# Altium schematic sheet nRF24L01-Module.SchDoc
size A4
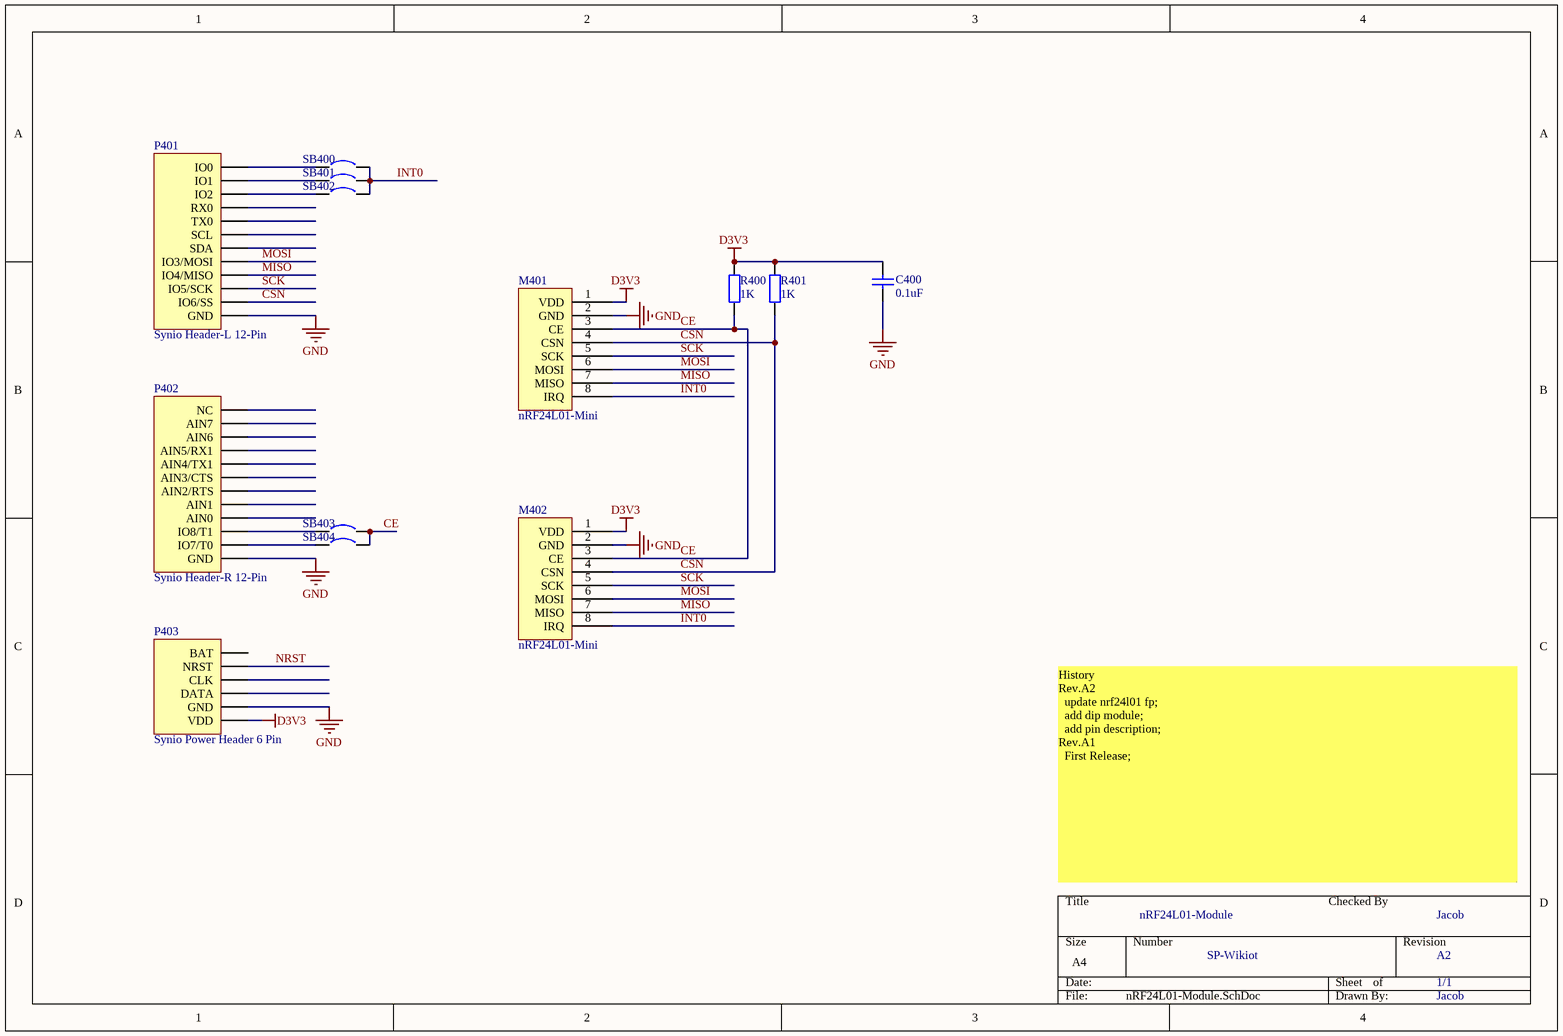
[diagram p0: nRF24L01-Module.SchDoc]

## Parts
C400  0.1uF  [C0603L]
M401  nRF24L01-Mini  [nRF24L01-Mini-All]
M402  nRF24L01-Mini  [nRF24L01-DIP]
P401  Synio Header-L 12-Pin  [HDR1X12]
P402  Synio Header-R 12-Pin  [HDR1X12]
P403  Synio Power Header 6 Pin  [HDR1X6/2.54MM]
R400  1K  [R0603]
R401  1K  [R0603]
SB400  Circuit Breaker  [JP2_SMD]  (value not drawn)
SB401  Circuit Breaker  [JP2_SMD]  (value not drawn)
SB402  Circuit Breaker  [JP2_SMD]  (value not drawn)
SB403  Circuit Breaker  [JP2_SMD]  (value not drawn)
SB404  Circuit Breaker  [JP2_SMD]  (value not drawn)

## Nets
D3V3: C400.1 M401.1(VDD) M402.1(VDD) P403.1(VDD) R400.1 R401.1
GND: C400.2 M401.2(GND) M402.2(GND) P401.1(GND) P402.1(GND) P403.2(GND)
CE: M401.3(CE) M402.3(CE) R400.2 SB403.2 SB404.2
CSN: M401.4(CSN) M402.4(CSN) P401.2(IO6/SS) R401.2
INT0: M401.8(IRQ) M402.8(IRQ) SB400.2 SB401.2 SB402.2
MISO: M401.7(MISO) M402.7(MISO) P401.4(IO4/MISO)
MOSI: M401.6(MOSI) M402.6(MOSI) P401.5(IO3/MOSI)
NRST: P403.5(NRST)
SCK: M401.5(SCK) M402.5(SCK) P401.3(IO5/SCK)
NetP401_10: P401.10(IO2) SB402.1
NetP401_11: P401.11(IO1) SB401.1
NetP401_12: P401.12(IO0) SB400.1
NetP402_2: P402.2(IO7/T0) SB404.1
NetP402_3: P402.3(IO8/T1) SB403.1

Not connected (* = marked no-connect by the designer): P401 6(SDA) 7(SCL) 8(TX0) 9(RX0); P402 4(AIN0) 5(AIN1) 6(AIN2/RTS) 7(AIN3/CTS) 8(AIN4/TX1) 9(AIN5/RX1) 10(AIN6) 11(AIN7) 12(NC); P403 3(DATA) 4(CLK) 6(BAT)

## Notes on the sheet
- History
  Rev.A2
  update nrf24l01 fp;
  add dip module;
  add pin description;
  Rev.A1
  First Release;
- nRF24L01-Module
- Checked By
- Jacob
- SP-Wikiot
- A2
- 1/1

## Library data of the parts
C400 = Cap: Capacitor; Published: 8-Jun-2000; LatestRevisionDate: 17-Jul-2002; LatestRevisionNote: Re-released for DXP Platform.; PackageReference: RAD-0.3; Value: 0.1uF
P401 = Synio Header-L 12-Pin: Synio Header-L, 12-Pin; LatestRevisionDate: 17-Jul-2002; LatestRevisionNote: Re-released for DXP Platform.; Publisher: Altium Limited
P402 = Synio Header-R 12-Pin: Synio Header-R, 12-Pin; LatestRevisionDate: 17-Jul-2002; LatestRevisionNote: Re-released for DXP Platform.; Publisher: Altium Limited
R400 R401 = Res: Resistor; Published: 8-Jun-2000; LatestRevisionDate: 17-Jul-2002; LatestRevisionNote: Re-released for DXP Platform.; PackageReference: AXIAL-0.4; Publisher: Altium Limited; Value: 1K
SB400-SB404 = Circuit Breaker: Solder: YES; Published: 24-Mar-1999; Revision: July-2002: Re-released for DXP Platform.; Publisher: Altium Limited